# Altium schematic sheet POWER+HALL.SchDoc (part 2 of 3)
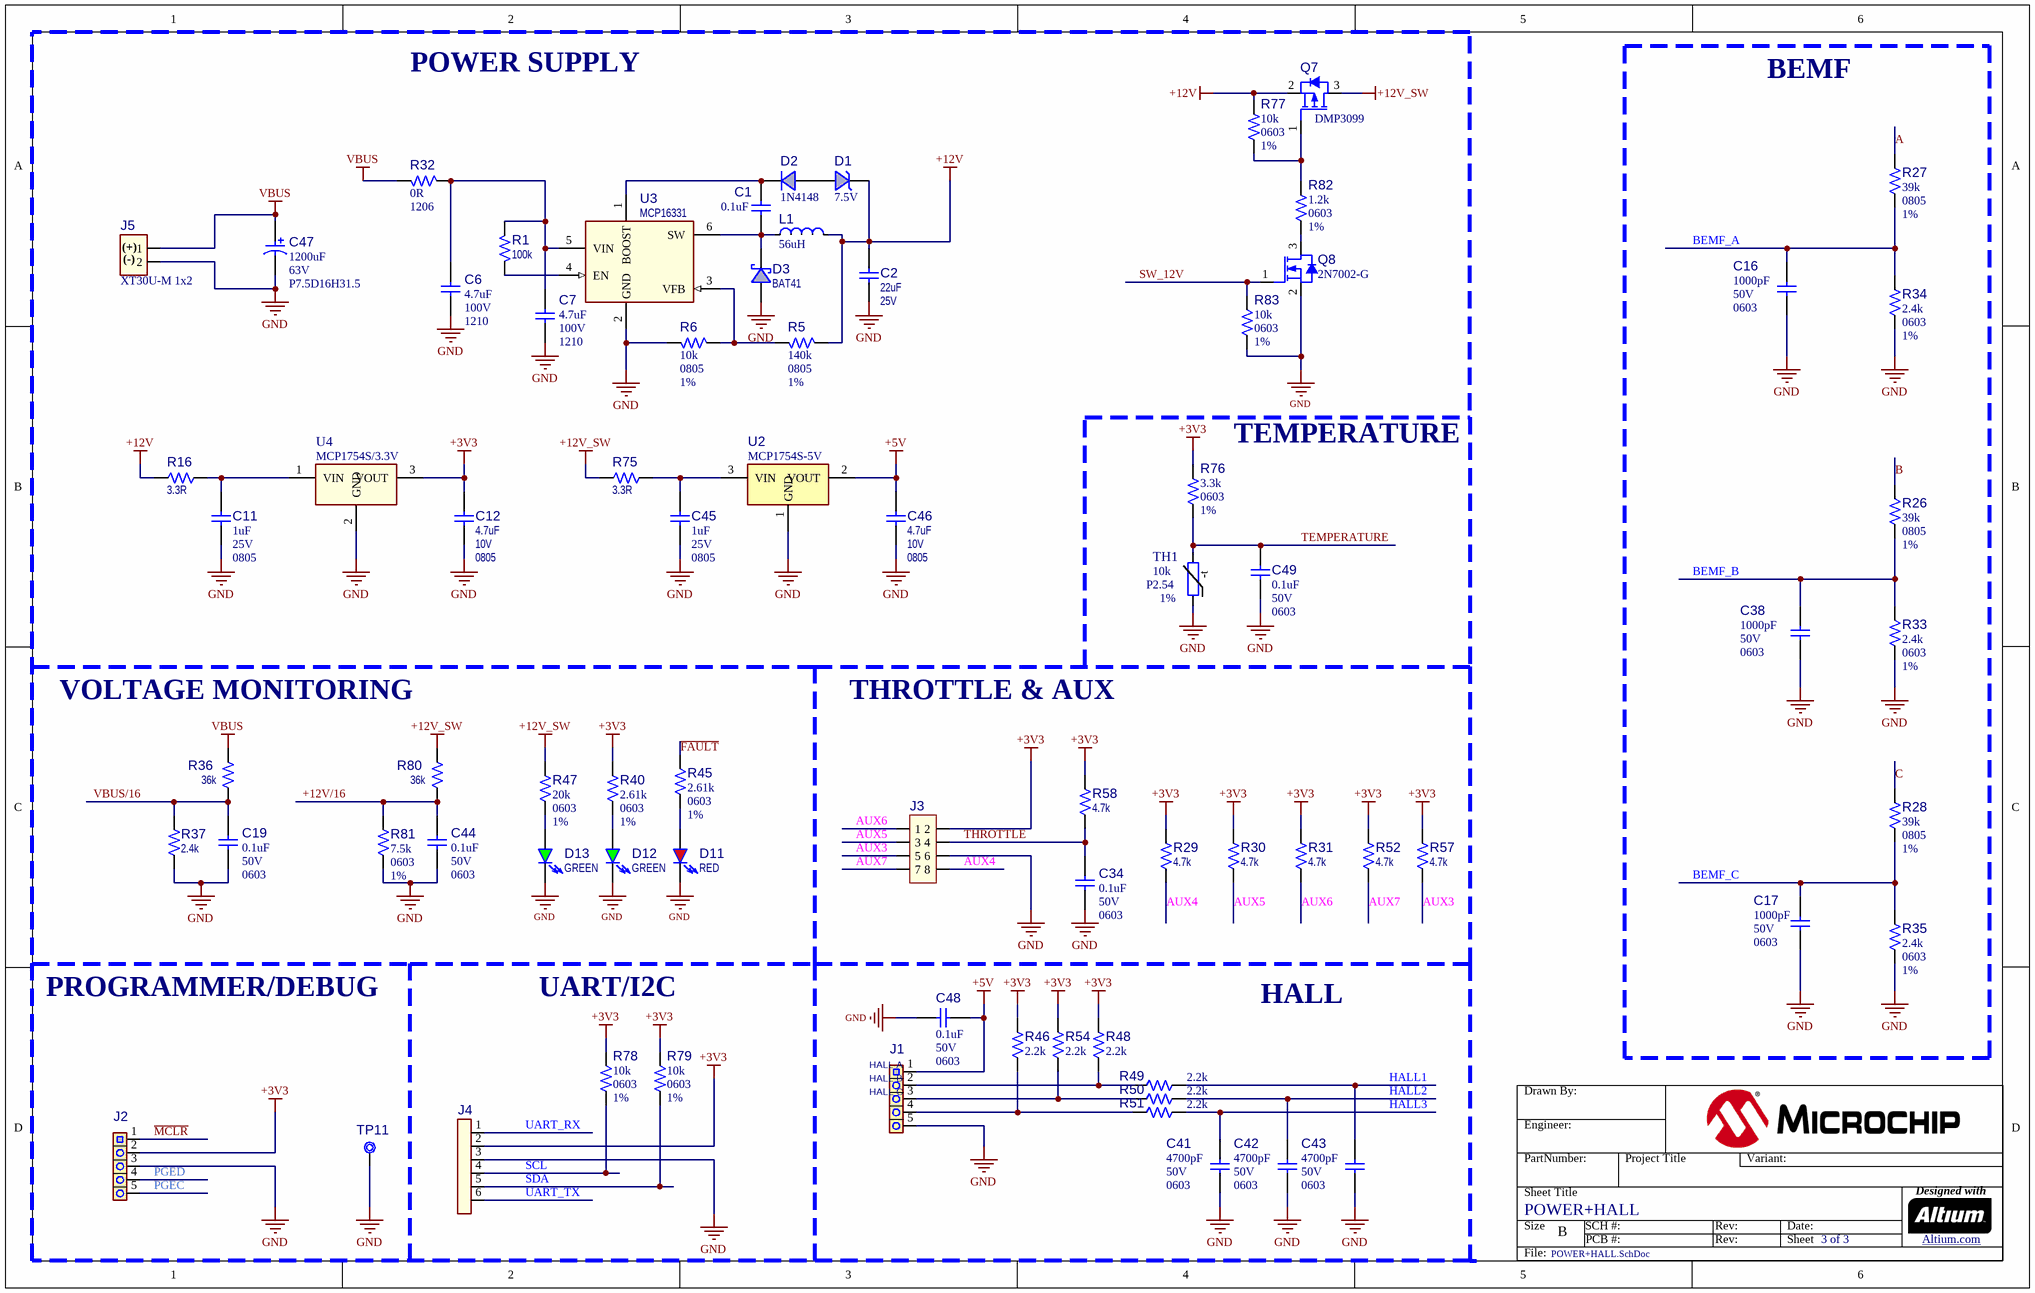
[diagram p1: POWER+HALL.SchDoc]
## Library data of the parts
? = Title Block B
C1 = CAP2016: Capacitor; Manufacturer 1: AVX Corporation; Manufacturer Part Number 1: 06035C104K4Z4A; Voltage: 50V; Description_: CAP CER 0.1uF 50V 10% X7R AEC-Q200 SMD 0603; Dev Tools Status: Design; Tolerance: 10%; Temperature Coeffcient: X7R; Type: Ceramic; Owner: Sam Charles; Populated: YES; MCHP-ID: CAP2016; Package: 0603; Revision: A; Symbol: Capacitor NP; Status: MCL Design; ComponentLink1URL: https://chn-vm-apps.microchip.com/mchprepo/parts/Datasheets/FlexitermMLCC.pdf; ComponentLink1Description: SVN Datasheet; ComponentLink2URL: C:\ALTIUM_WORK\00001_MCHP-CDB\Datasheets\FlexitermMLCC.pdf; ComponentLink2Description: Local Datasheet; ComponentLink3URL: C:\ALTIUM_WORK\00001_MCHP-CDB\Library\LibraryRefs\Capacitor NP.SchLib; ComponentLink3Description: Open Symbol; ComponentLink4URL: C:\ALTIUM_WORK\00001_MCHP-CDB\Library\Footprints\CAP_C_0603.PcbLib; ComponentLink4Description: Open Footprint; ComponentLink5Description: Open Footprint 2; ComponentLink6Description: Open Footprint 3; ComponentLink7Description: Open Footprint 4; Operating Temperature: -55°C ~ 125°C; Category: Capacitor; Supplier 1: Digi-Key; Supplier Part Number 1: 478-10679-1-ND; Quantity Override: 1
C2 = CAP1579: Capacitor; Manufacturer 1: Murata Electronics North America                                                                               Murata Electronics North America; Manufacturer Part Number 1: GRM31CR61E226KE15L; Description_: CAP CER 22uF 25V 10% X5R SMD 1206; Dev Tools Status: Production; Tolerance: 10%; Type: Ceramic; Owner: Jose Garcia; Populated: YES; MCHP-ID: CAP1579; Package: 1206; Revision: 2; Symbol: Capacitor NP; Status: MCL Design; ComponentLink1URL: https://chn-vm-apps.microchip.com/mchprepo/parts/Datasheets/c02e.pdf; ComponentLink1Description: SVN Datasheet; ComponentLink2URL: C:\ALTIUM_WORK\00001_MCHP-CDB\Datasheets\c02e.pdf; ComponentLink2Description: Local Datasheet; ComponentLink3URL: C:\ALTIUM_WORK\00001_MCHP-CDB\Library\LibraryRefs\Capacitor NP.SchLib; ComponentLink3Description: Open Symbol; ComponentLink4URL: C:\ALTIUM_WORK\00001_MCHP-CDB\Library\Footprints\CAP_C_1206.PcbLib; ComponentLink4Description: Open Footprint; ComponentLink5Description: Open Footprint 2; ComponentLink6Description: Open Footprint 3; ComponentLink7Description: Open Footprint 4; Operating Temperature: -55°C to +85°C; Category: Capacitor; Supplier 1: Digi-Key; Supplier Part Number 1: 490-5527-1-ND; Quantity Override: 1
C6 C7 = CAP1988: Capacitor; Manufacturer 1: Taiyo Yuden; Manufacturer Part Number 1: HMK325C7475KMHPE; Description_: CAP CER 4.7uF 100V 10% X7S SMD 1210 AEC-Q200; Dev Tools Status: Production; Tolerance: 10%; Temperature Coeffcient: X7S; Type: Ceramic; Owner: Cristian Papuc; Populated: YES; MCHP-ID: CAP1988; Revision: 1; Symbol: Capacitor NP; Status: MCL Design; ComponentLink1URL: https://chn-vm-apps.microchip.com/mchprepo/parts/Datasheets/HMK325C7475KMHPE_SS.pdf; ComponentLink1Description: SVN Datasheet; ComponentLink2URL: C:\ALTIUM_WORK\00001_MCHP-CDB\Datasheets\HMK325C7475KMHPE_SS.pdf; ComponentLink2Description: Local Datasheet; ComponentLink3URL: C:\ALTIUM_WORK\00001_MCHP-CDB\Library\LibraryRefs\Capacitor NP.SchLib; ComponentLink3Description: Open Symbol; ComponentLink4URL: C:\ALTIUM_WORK\00001_MCHP-CDB\Library\Footprints\CAP_C_1210.PcbLib; ComponentLink4Description: Open Footprint; ComponentLink5Description: Open Footprint 2; ComponentLink6Description: Open Footprint 3; ComponentLink7Description: Open Footprint 4; Operating Temperature: -55C to +125C; Category: Capacitor; Supplier 1: Digi-Key; Supplier Part Number 1: 587-5037-1-ND; Quantity Override: 1
C11 C45 = CAP1211: Capacitor; Manufacturer 1: AVX; Manufacturer Part Number 1: 08053C105K4Z2A; Description_: CAP CER 1uF 25V 10% X7R SMD 0805; Dev Tools Status: Production; Tolerance: 10%; Temperature Coeffcient: X7R; Type: Ceramic; Owner: Tad Ahlvers; Populated: YES; MCHP-ID: CAP1211; Revision: 1; Symbol: Capacitor NP; Status: MCL Design; ComponentLink1URL: https://chn-vm-apps.microchip.com/mchprepo/parts/Datasheets/flexiterm.pdf; ComponentLink1Description: SVN Datasheet; ComponentLink2URL: C:\ALTIUM_WORK\00001_MCHP-CDB\Datasheets\flexiterm.pdf; ComponentLink2Description: Local Datasheet; ComponentLink3URL: C:\ALTIUM_WORK\00001_MCHP-CDB\Library\LibraryRefs\Capacitor NP.SchLib; ComponentLink3Description: Open Symbol; ComponentLink4URL: C:\ALTIUM_WORK\00001_MCHP-CDB\Library\Footprints\CAP_C_0805.PcbLib; ComponentLink4Description: Open Footprint; ComponentLink5Description: Open Footprint 2; ComponentLink6Description: Open Footprint 3; ComponentLink7Description: Open Footprint 4; Operating Temperature: -55C to +125C; Category: Capacitor; Manufacturer 2: KEMET; Manufacturer Part Number 2: C0805C105K3RACTU; Manufacturer 3: TDK Corporation; Manufacturer Part Number 3: C2012X7R1E105K125AB; Supplier 1: Digi-Key; Supplier Part Number 1: 478-6357-2-ND; Supplier 2: Digi-Key; Supplier Part Number 2: C0805C105K3RACTU-ND; Supplier 3: Digi-Key; Supplier Part Number 3: 445-1354-1-ND; Quantity Override: 1
C12 C46 = CAP1268: Capacitor; Manufacturer 1: TDK Corporation; Manufacturer Part Number 1: C2012X7R1A475M125AC; Description_: CAP CER 4.7uF 10V 20% X7R SMD 0805; Dev Tools Status: Production; Tolerance: 20%; Temperature Coeffcient: X7R; Type: Ceramic; Owner: Mark Loper; Populated: YES; MCHP-ID: CAP1268; Revision: 1; Symbol: Capacitor NP; Status: MCL Design; ComponentLink1URL: https://chn-vm-apps.microchip.com/mchprepo/parts/Datasheets/mlcc_commercial_general_en.pdf; ComponentLink1Description: SVN Datasheet; ComponentLink2URL: C:\ALTIUM_WORK\00001_MCHP-CDB\Datasheets\mlcc_commercial_general_en.pdf; ComponentLink2Description: Local Datasheet; ComponentLink3URL: C:\ALTIUM_WORK\00001_MCHP-CDB\Library\LibraryRefs\Capacitor NP.SchLib; ComponentLink3Description: Open Symbol; ComponentLink4URL: C:\ALTIUM_WORK\00001_MCHP-CDB\Library\Footprints\CAP_C_0805.PcbLib; ComponentLink4Description: Open Footprint; ComponentLink5Description: Open Footprint 2; ComponentLink6Description: Open Footprint 3; ComponentLink7Description: Open Footprint 4; Operating Temperature: -55C to +125C; Category: Capacitor; Supplier 1: Digi-Key; Supplier Part Number 1: 445-1605-1-ND; Quantity Override: 1
C16 C17 C38 = CAP0031: Capacitor; Manufacturer 1: Wurth Electronics Inc; Manufacturer Part Number 1: 885012206083; Description_: CAP CER 1000pF 50V 10% X7R SMD 0603; Dev Tools Status: Production; Tolerance: 10%; Temperature Coeffcient: X7R; Type: Ceramic; Populated: Yes; MCHP-ID: CAP0031; Revision: 2; Symbol: Capacitor NP; Status: MCL Design; ComponentLink1URL: https://chn-vm-apps.microchip.com/mchprepo/parts/Datasheets/KEM_C1002_X7R_SMD.pdf; ComponentLink1Description: SVN Datasheet; ComponentLink2URL: C:\ALTIUM_WORK\00001_MCHP-CDB\Datasheets\KEM_C1002_X7R_SMD.pdf; ComponentLink2Description: Local Datasheet; ComponentLink3URL: C:\ALTIUM_WORK\00001_MCHP-CDB\Library\LibraryRefs\Capacitor NP.SchLib; ComponentLink3Description: Open Symbol; ComponentLink4URL: C:\ALTIUM_WORK\00001_MCHP-CDB\Library\Footprints\CAP_C_0603.PcbLib; ComponentLink4Description: Open Footprint; ComponentLink5Description: Open Footprint 2; ComponentLink6Description: Open Footprint 3; ComponentLink7Description: Open Footprint 4; Operating Temperature: -55C to +125C; Category: Capacitor; Manufacturer 2: Cal-Chip; Manufacturer Part Number 2: GMC10X7R102K50NTL_F; Manufacturer 3: AVX; Manufacturer Part Number 3: 06035C102KAT2A; Manufacturer 4: KEMET; Manufacturer Part Number 4: C0603C102K5RACTU; Manufacturer 5: Murata Electronics North America; Manufacturer Part Number 5: GCM188R71H102KA37J; Manufacturer 6: Panasonic; Manufacturer Part Number 6: ECU-V1H102KBV; Manufacturer 7: Panasonic; Manufacturer Part Number 7: ECJ-1VB1H102K; Manufacturer 8: NIC Components; Manufacturer Part Number 8: NMC0603X7R102K50TRPF; Supplier 1: Digi-Key; Supplier Part Number 1: 732-8001-1-ND; Supplier 2: Cal-Chip; Supplier Part Number 2: GMC10X7R102K50NTL_F; Supplier 3: Digi-Key; Supplier Part Number 3: 478-1215-1-ND; Supplier 4: Digi-Key; Supplier Part Number 4: 399-1082-1-ND; Supplier 5: Digi-Key; Supplier Part Number 5: 490-8019-1-ND; Supplier 6: Digi-Key; Supplier Part Number 6: PCC102BVTR-ND; Supplier 7: Digi-Key; Supplier Part Number 7: PCC1772TR-ND; Supplier 8: NIC Components; Supplier Part Number 8: NMC0603X7R102K50TRPF; Quantity Override: 1
C19 C34 C44 C48 C49 = CAP2016: Capacitor; Manufacturer 1: AVX Corporation; Manufacturer Part Number 1: 06035C104K4Z4A; Description_: CAP CER 0.1uF 50V 10% X7R AEC-Q200 SMD 0603; Dev Tools Status: Design; Tolerance: 10%; Temperature Coeffcient: X7R; Type: Ceramic; Owner: Sam Charles; Populated: YES; MCHP-ID: CAP2016; Revision: A; Symbol: Capacitor NP; Status: MCL Design; ComponentLink1URL: https://chn-vm-apps.microchip.com/mchprepo/parts/Datasheets/FlexitermMLCC.pdf; ComponentLink1Description: SVN Datasheet; ComponentLink2URL: C:\ALTIUM_WORK\00001_MCHP-CDB\Datasheets\FlexitermMLCC.pdf; ComponentLink2Description: Local Datasheet; ComponentLink3URL: C:\ALTIUM_WORK\00001_MCHP-CDB\Library\LibraryRefs\Capacitor NP.SchLib; ComponentLink3Description: Open Symbol; ComponentLink4URL: C:\ALTIUM_WORK\00001_MCHP-CDB\Library\Footprints\CAP_C_0603.PcbLib; ComponentLink4Description: Open Footprint; ComponentLink5Description: Open Footprint 2; ComponentLink6Description: Open Footprint 3; ComponentLink7Description: Open Footprint 4; Operating Temperature: -55°C ~ 125°C; Category: Capacitor; Supplier 1: Digi-Key; Supplier Part Number 1: 478-10679-1-ND; Quantity Override: 1
C41-C43 = CAP1116: Manufacturer 1: KEMET; Manufacturer Part Number 1: C0603C472K5RACTU; Description_: CAP CER 4700pF 50V 10% X7R SMD 0603; Dev Tools Status: Production; Tolerance: 10%; Temperature Coeffcient: X7R; Type: Ceramic; Populated: YES; Owner: Miahi T(M91442); MCHP-ID: CAP1116; Revision: 0; Symbol: Capacitor NP; Status: MCL Design; ComponentLink1URL: https://chn-vm-apps.microchip.com/mchprepo/parts/Datasheets/KEM_C1002_X7R_SMD.pdf; ComponentLink1Description: SVN Datasheet; ComponentLink2URL: C:\ALTIUM_WORK\00001_MCHP-CDB\Datasheets\KEM_C1002_X7R_SMD.pdf; ComponentLink2Description: Local Datasheet; ComponentLink3URL: C:\ALTIUM_WORK\00001_MCHP-CDB\Library\LibraryRefs\Capacitor NP.SchLib; ComponentLink3Description: Open Symbol; ComponentLink4URL: C:\ALTIUM_WORK\00001_MCHP-CDB\Library\Footprints\CAP_C_0603.PcbLib; ComponentLink4Description: Open Footprint; ComponentLink5Description: Open Footprint 2; ComponentLink6Description: Open Footprint 3; ComponentLink7Description: Open Footprint 4; Operating Temperature: -55C to +125C; Category: Capacitor; Supplier 1: Digi-Key; Supplier Part Number 1: 399-1087-1-ND; Supplier 2: Farnell; Supplier Part Number 2: 1414642; Quantity Override: 1
C47 = CAP2449: Capacitor; Manufacturer 1: Wurth Electronics; Manufacturer Part Number 1: 860040780019; Description_: CAP ALU 1200uF 63V 20% RAD P7.5D16H31.5; Dev Tools Status: Design; Tolerance: 20%; Type: Aluminum; Owner: Cristina Salanti; Populated: YES; MCHP-ID: CAP2449; Revision: 1; Symbol: Capacitor POL; Status: MCL Design; ComponentLink1URL: https://chn-vm-apps.microchip.com/mchprepo/parts/Datasheets/860040780019.pdf; ComponentLink1Description: SVN Datasheet; ComponentLink2URL: C:\ALTIUM_WORK\00001_MCHP-CDB\Datasheets\860040780019.pdf; ComponentLink2Description: Local Datasheet; ComponentLink3URL: C:\ALTIUM_WORK\00001_MCHP-CDB\Library\LibraryRefs\Capacitor POL.SchLib; ComponentLink3Description: Open Symbol; ComponentLink4URL: C:\ALTIUM_WORK\00001_MCHP-CDB\Library\Footprints\CAP_RAD_P7.5D16H31.5.PcbLib; ComponentLink4Description: Open Footprint; ComponentLink5Description: Open Footprint 2; ComponentLink6Description: Open Footprint 3; ComponentLink7Description: Open Footprint 4; Operating Temperature: -40C to +105C; Category: Capacitor; Supplier 1: Digikey; Supplier Part Number 1: 732-9250-ND; Quantity Override: 1
D1 = DIODE1401: Manufacturer 1: ON Semiconductor; Manufacturer Part Number 1: MMSZ7V5T1G; Description_: DIO ZNR MMSZ7V5T1G 7.5V 500mW SMD SOD-123; Dev Tools Status: Production; Type: Zener Single; Power: 500mW; Reverse Current: 1µA@5V; Owner: Cristian Papuc; Populated: YES; MCHP-ID: DIODE1401; Revision: 1; Symbol: Diode Zener; Status: MCL Design; Package: SOD-123; ComponentLink1URL: https://chn-vm-apps.microchip.com/mchprepo/parts/Datasheets/MMSZ2V4T1-D.PDF; ComponentLink1Description: SVN Datasheet; ComponentLink2URL: C:\ALTIUM_WORK\00001_MCHP-CDB\Datasheets\MMSZ2V4T1-D.PDF; ComponentLink2Description: Local Datasheet; ComponentLink3URL: C:\ALTIUM_WORK\00001_MCHP-CDB\Library\LibraryRefs\Diode Zener.SchLib; ComponentLink3Description: Open Symbol; ComponentLink4URL: C:\ALTIUM_WORK\00001_MCHP-CDB\Library\Footprints\SOD-123.PcbLib; ComponentLink4Description: Open Footprint; ComponentLink5Description: Open Footprint 2; ComponentLink6Description: Open Footprint 3; ComponentLink7Description: Open Footprint 4; Operating Temperature: -55°C ~ 150°C; Category: Diode; Supplier 1: Digi-Key; Supplier Part Number 1: MMSZ7V5T1GOSCT-ND; Quantity Override: 1
D2 = DIODE0165: Manufacturer 1: Fairchild; Manufacturer Part Number 1: 1N4148WS; Description_: DIO RECT 1N4148 1V 150mA 100V SOD-323; Dev Tools Status: Production; Type: Rectifier Single; Forward Current: 150mA; Power: 200mW; Reverse Current: 5uA; Reverse Voltage: 100V; Populated: Yes; MCHP-ID: DIODE0165; Revision: 1; Symbol: Diode Single; Status: MCL Design; Package: SOD-323; ComponentLink1URL: https://chn-vm-apps.microchip.com/mchprepo/parts/Datasheets/1N4148WS.pdf; ComponentLink1Description: SVN Datasheet; ComponentLink2URL: C:\ALTIUM_WORK\00001_MCHP-CDB\Datasheets\1N4148WS.pdf; ComponentLink2Description: Local Datasheet; ComponentLink3URL: C:\ALTIUM_WORK\00001_MCHP-CDB\Library\LibraryRefs\Diode Single.SchLib; ComponentLink3Description: Open Symbol; ComponentLink4URL: C:\ALTIUM_WORK\00001_MCHP-CDB\Library\Footprints\SOD-323.PcbLib; ComponentLink4Description: Open Footprint; ComponentLink5Description: Open Footprint 2; ComponentLink6Description: Open Footprint 3; ComponentLink7Description: Open Footprint 4; Operating Temperature: -55C to +150C; Category: Diode; Supplier 1: Digi-Key; Supplier Part Number 1: 1N4148WSFSCT-ND; Quantity Override: 1
D3 = DIODE0160: Manufacturer 1: STMicroelectronics; Manufacturer Part Number 1: BAT41ZFILM; Description_: DIO SCTKY BAT41 1V 200mA 100V SOD-123; Dev Tools Status: Production; Type: Schottky Single; Forward Current: 200mA; Reverse Current: 100nA; Reverse Voltage: 100V; Populated: Yes; MCHP-ID: DIODE0160; Revision: 1; Symbol: Diode Schottky; Status: MCL Design; Package: SOD-123; ComponentLink1URL: https://chn-vm-apps.microchip.com/mchprepo/parts/Datasheets/CD00130227.pdf; ComponentLink1Description: SVN Datasheet; Operating Temperature: -65C to +150C; Category: Diode; Supplier 1: Digi-Key; Supplier Part Number 1: 497-5558-1-ND; Quantity Override: 1; ComponentLink2Description: Local Datasheet; ComponentLink2URL: C:\ALTIUM_WORK\00001_MCHP-CDB\Datasheets\CD00130227.pdf; ComponentLink3Description: Open Symbol; ComponentLink3URL: C:\ALTIUM_WORK\00001_MCHP-CDB\Library\LibraryRefs\Diode Schottky.SchLib; ComponentLink4Description: Open Footprint; ComponentLink4URL: C:\ALTIUM_WORK\00001_MCHP-CDB\Library\Footprints\SOD-123.PcbLib; ComponentLink5Description: Open Footprint 2; ComponentLink6Description: Open Footprint 3; ComponentLink7Description: Open Footprint 4
D11 = DIODE1058: LED; Manufacturer 1: Lite-On; Manufacturer Part Number 1: LTST-C190EKT; Description_: DIO LED RED 2V 30mA 2mcd Clear SMD 0603; Dev Tools Status: Production; Type: LED Single; Forward Current: 30mA; Power: 100mW; Reverse Current: 100uA; Reverse Voltage: 5V; Owner: Tad Ahlvers; Populated: YES; MCHP-ID: DIODE1058; Revision: 2; Symbol: LED_red; Status: MCL Design; Package: 0603; ComponentLink1URL: https://chn-vm-apps.microchip.com/mchprepo/parts/Datasheets/LTST-C190EKT.pdf; ComponentLink1Description: SVN Datasheet; ComponentLink2URL: C:\ALTIUM_WORK\00001_MCHP-CDB\Datasheets\LTST-C190EKT.pdf; ComponentLink2Description: Local Datasheet; ComponentLink3URL: C:\ALTIUM_WORK\00001_MCHP-CDB\Library\LibraryRefs\LED_red.SchLib; ComponentLink3Description: Open Symbol; ComponentLink4URL: C:\ALTIUM_WORK\00001_MCHP-CDB\Library\Footprints\LED_0603_RED.PcbLib; ComponentLink4Description: Open Footprint; ComponentLink5Description: Open Footprint 2; ComponentLink6Description: Open Footprint 3; ComponentLink7Description: Open Footprint 4; Operating Temperature: -55C to +85C; Category: Diode; Manufacturer 2: ZhiDing; Manufacturer Part Number 2: AL-S0603SRC-50-08-2; Supplier 1: Digi-Key; Supplier Part Number 1: 160-1182-1-ND; Supplier 2: Raynen; Supplier Part Number 2: AL-S0603SRC-50-08-2; Quantity Override: 1
D12 D13 = DIODE1155: LED; Manufacturer 1: Lite-On Inc; Manufacturer Part Number 1: LTST-C191KGKT; Description_: DIO LED GREEN 2V 30mA 35mcd Clear SMD 0603; Dev Tools Status: Production; Type: LED Single; Forward Current: 30mA; Power: 75mW; Reverse Voltage: 5V; Owner: Tad Ahlvers; Populated: YES; MCHP-ID: DIODE1155; Revision: 1; Symbol: LED_green; Status: MCL Design; ComponentLink1URL: https://chn-vm-apps.microchip.com/mchprepo/parts/Datasheets/S_110_LTST-C191KGKT.pdf; ComponentLink1Description: SVN Datasheet; ComponentLink2URL: C:\ALTIUM_WORK\00001_MCHP-CDB\Datasheets\S_110_LTST-C191KGKT.pdf; ComponentLink2Description: Local Datasheet; ComponentLink3URL: C:\ALTIUM_WORK\00001_MCHP-CDB\Library\LibraryRefs\LED_green.SchLib; ComponentLink3Description: Open Symbol; ComponentLink4URL: C:\ALTIUM_WORK\00001_MCHP-CDB\Library\Footprints\LED_0603_GREEN.PcbLib; ComponentLink4Description: Open Footprint; ComponentLink5Description: Open Footprint 2; ComponentLink6Description: Open Footprint 3; ComponentLink7Description: Open Footprint 4; Operating Temperature: -55C to +85C; Category: Diode; Manufacturer 2: Ledtech; Manufacturer Part Number 2: LT8A23-54-SB96-T5; Supplier 1: Digi-Key; Supplier Part Number 1: 160-1446-1-ND; Supplier 2: Raynen; Supplier Part Number 2: LEDD00036B01; Quantity Override: 1
J1 J2 = CON0416: Manufacturer 1: FCI; Manufacturer Part Number 1: 68000-105HLF; Value: HDR-2.54 Male 1x5; Description_: CON HDR-2.54 Male 1x5 Gold 5.84MH TH VERT; Dev Tools Status: Production; Populated: Yes; MCHP-ID: CON0416; Revision: 1; Symbol: Header 1x5; Status: MCL Design; ComponentLink1URL: https://chn-vm-apps.microchip.com/mchprepo/parts/Datasheets/TSW-XXX-XX-XXX-X-XX-XXX-MKT.pdf; ComponentLink1Description: SVN Datasheet; ComponentLink2URL: C:\ALTIUM_WORK\00001_MCHP-CDB\Datasheets\TSW-XXX-XX-XXX-X-XX-XXX-MKT.pdf; ComponentLink2Description: Local Datasheet; ComponentLink3URL: C:\ALTIUM_WORK\00001_MCHP-CDB\Library\LibraryRefs\Header 1x5.SchLib; ComponentLink3Description: Open Symbol; ComponentLink4URL: C:\ALTIUM_WORK\00001_MCHP-CDB\Library\Footprints\HDR_M_2.54_1x5.PcbLib; ComponentLink4Description: Open Footprint; ComponentLink5Description: Open Footprint 2; ComponentLink6Description: Open Footprint 3; ComponentLink7Description: Open Footprint 4; Type: Header 2.54mm; Category: Connector; Manufacturer 2: Samtec; Manufacturer Part Number 2: TSW-105-07-S-S; Manufacturer 3: Nextron; Manufacturer Part Number 3: 211-051A7-0021-400; Supplier 1: Digi-Key; Supplier Part Number 1: 609-3462-ND; Supplier 2: Digi-Key; Supplier Part Number 2: SAM1033-05-ND; Supplier 3: Raynen; Supplier Part Number 3: CONN00303A01M; Quantity Override: 1
J3 = CON0118: Manufacturer 1: Wurth Electronics Inc; Manufacturer Part Number 1: 61300821121; Value: HDR-2.54 Male 2x4; Description_: CON HDR-2.54 Male 2x4 Gold 5.84MH  TH VERT; Dev Tools Status: Production; Owner: Randolph Sobrepena; Populated: Yes; MCHP-ID: CON0118; Revision: 2; Symbol: Header 2x4; Status: MCL Design; ComponentLink1URL: https://chn-vm-apps.microchip.com/mchprepo/parts/Datasheets/TSW-XXX-XX-XXX-X-XX-XXX-MKT.pdf; ComponentLink1Description: SVN Datasheet; ComponentLink2URL: C:\ALTIUM_WORK\00001_MCHP-CDB\Datasheets\TSW-XXX-XX-XXX-X-XX-XXX-MKT.pdf; ComponentLink2Description: Local Datasheet; ComponentLink3URL: C:\ALTIUM_WORK\00001_MCHP-CDB\Library\LibraryRefs\Header 2x4.SchLib; ComponentLink3Description: Open Symbol; ComponentLink4URL: C:\ALTIUM_WORK\00001_MCHP-CDB\Library\Footprints\HDR_M_2.54_2x4.PcbLib; ComponentLink4Description: Open Footprint; ComponentLink5Description: Open Footprint 2; ComponentLink6Description: Open Footprint 3; ComponentLink7Description: Open Footprint 4; Type: Header 2.54mm; Category: Connector; Manufacturer 2: Sullins; Manufacturer Part Number 2: PBC04DAAN; Supplier 1: Digi-Key; Supplier Part Number 1: 732-5296-ND; Supplier 2: Digi-Key; Supplier Part Number 2: S2011E-04-ND; Quantity Override: 1; Manufacturer 3: Samtec; Manufacturer Part Number 3: TSW-104-07-G-D; Manufacturer 4: Samtec; Manufacturer Part Number 4: TSW-104-07-S-D; Manufacturer 5: SHENZHEN JUNHAO ENGINEERING; Manufacturer Part Number 5: R-213-0811-0021-400; Supplier 3: Samtec; Supplier Part Number 3: TSW-104-07-G-D; Supplier 4: Samtec; Supplier Part Number 4: TSW-104-07-S-D; Supplier 5: Raynen; Supplier Part Number 5: CONN00267B01
J4 = CON2100: Manufacturer 1: WURTH ELEKTRONIK; Manufacturer Part Number 1: 61300611121; Value: HDR-2.54 Male 1x6; Description_: CON HDR-2.54 Male 1x6 Tin 5.84MH TH VERT; Dev Tools Status: Production; Owner: Octavian Stroe; Populated: YES; Current: 3A; MCHP-ID: CON2100; Revision: 1; Symbol: Header 1x6; Status: MCL Design; ComponentLink1URL: https://chn-vm-apps.microchip.com/mchprepo/parts/Datasheets/6130xx11121.pdf; ComponentLink1Description: SVN Datasheet; ComponentLink2URL: C:\ALTIUM_WORK\00001_MCHP-CDB\Datasheets\6130xx11121.pdf; ComponentLink2Description: Local Datasheet; ComponentLink3URL: C:\ALTIUM_WORK\00001_MCHP-CDB\Library\LibraryRefs\Header 1x6.SchLib; ComponentLink3Description: Open Symbol; ComponentLink4URL: C:\ALTIUM_WORK\00001_MCHP-CDB\Library\Footprints\HDR_M_2.54_1x6.PcbLib; ComponentLink4Description: Open Footprint; ComponentLink5Description: Open Footprint 2; ComponentLink6Description: Open Footprint 3; ComponentLink7Description: Open Footprint 4; Type: Header 2.54mm; Category: Connector; Supplier 1: Digi-Key; Supplier Part Number 1: 732-5319-ND; Quantity Override: 1
J5 = CON2207: Manufacturer 1: AMASS; Manufacturer Part Number 1: XT30U-M; Description_: CON POWER XT30U-M 5mm 1x2 Male 15A TH V; Dev Tools Status: Design; Owner: Octavian Stroe; Voltage: 500V; Current: 15A; Populated: YES; MCHP-ID: CON2207; Revision: 1; Symbol: CON 1x2 POLARIZED; Status: MCL Design; ComponentLink1URL: https://chn-vm-apps.microchip.com/mchprepo/parts/Datasheets/XT30U SPEC.pdf; ComponentLink1Description: SVN Datasheet; ComponentLink2URL: C:\ALTIUM_WORK\00001_MCHP-CDB\Datasheets\XT30U SPEC.pdf; ComponentLink2Description: Local Datasheet; ComponentLink3URL: C:\ALTIUM_WORK\00001_MCHP-CDB\Library\LibraryRefs\CON 1x2 POLARIZED.SchLib; ComponentLink3Description: Open Symbol; ComponentLink4URL: C:\ALTIUM_WORK\00001_MCHP-CDB\Library\Footprints\CON TERMINAL XT30U-M 5mm 1x2 Male 30A TH V.PcbLib; ComponentLink4Description: Open Footprint; ComponentLink5Description: Open Footprint 2; ComponentLink6Description: Open Footprint 3; ComponentLink7Description: Open Footprint 4; Type: Power; Category: Connector; Supplier 1: TME; Supplier Part Number 1: XT30U-M; Quantity Override: 1
L1 = IND1145: Manufacturer 1: WURTH ELEKTRONIK; Manufacturer Part Number 1: 7447779156; Description_: INDUCTOR 56uH 0.93A 20% SMD L7.3W7.3H4.5; Dev Tools Status: Design; Owner: Bogdan P (M91398); DCR: 0.35R; Saturation Current: 1.05A; RMS Current: 0.93A; Test Frequency: 1kHz; Populated: YES; MCHP-ID: IND1145; Revision: A; Symbol: Inductor; Status: MCL Design; ComponentLink1URL: https://chn-vm-apps.microchip.com/mchprepo/parts/Datasheets/7447779156.pdf; ComponentLink1Description: SVN Datasheet; ComponentLink2URL: C:\ALTIUM_WORK\00001_MCHP-CDB\Datasheets\7447779156.pdf; ComponentLink2Description: Local Datasheet; ComponentLink3URL: C:\ALTIUM_WORK\00001_MCHP-CDB\Library\LibraryRefs\Inductor.SchLib; ComponentLink3Description: Open Symbol; ComponentLink4URL: C:\ALTIUM_WORK\00001_MCHP-CDB\Library\Footprints\IND_WE_WE-PD_L7.3W7.3H4.5.PcbLib; ComponentLink4Description: Open Footprint; ComponentLink5Description: Open Footprint 2; ComponentLink6Description: Open Footprint 3; ComponentLink7Description: Open Footprint 4; Operating Temperature: -40°C to +125°C; Package: L7.3W7.3H4.5; Type: Inductor; Category: Inductor; Supplier 1: Farnell; Supplier Part Number 1: 2082711; Quantity Override: 1
Q7 = TRA1191: Transistor MOS; Manufacturer 1: Diodes Incorporated; Manufacturer Part Number 1: DMP3099L-7; Description_: TRANS FET P-CH DMP3099L-7 -30V -3.8A 1.08W SOT-23-3; Dev Tools Status: Production; Type: FET; Current: -3.8A; Drain to Source Voltage: -30V; Gate to Source Voltage: 20V; Power: 1.08W; Owner: Alexandru Chiser - M19201; Populated: YES; MCHP-ID: TRA1191; Revision: 1; Symbol: Transistor MOS-P GSD; Status: MCL Design; Package: SOT-23-3; ComponentLink1URL: https://chn-vm-apps.microchip.com/mchprepo/parts/Datasheets/DMP3099L.pdf; ComponentLink1Description: SVN Datasheet; ComponentLink2URL: C:\ALTIUM_WORK\00001_MCHP-CDB\Datasheets\DMP3099L.pdf; ComponentLink2Description: Local Datasheet; ComponentLink3URL: C:\ALTIUM_WORK\00001_MCHP-CDB\Library\LibraryRefs\Transistor MOS-P GSD.SchLib; ComponentLink3Description: Open Symbol; ComponentLink4URL: C:\ALTIUM_WORK\00001_MCHP-CDB\Library\Footprints\SOT-23-3.PcbLib; ComponentLink4Description: Open Footprint; ComponentLink5Description: Open Footprint 2; ComponentLink6Description: Open Footprint 3; ComponentLink7Description: Open Footprint 4; Operating Temperature: -55C to +150C; Category: Transistor; Supplier 1: Digi-Key; Supplier Part Number 1: DMP3099L-7DICT-ND; Quantity Override: 1
Q8 = MIC7247: Transistor MOS; Manufacturer 1: Microchip Technology; Description_: MCHP ANALOG MOSFET N-CH 2N7002-G 60V 115mA SOT-23-3; Type: MOSFET; Dev Tools Status: Production; Owner: Mark Loper; Populated: YES; MCHP-ID: MIC7247; Symbol: Transistor MOS-N GSD; Status: MCL Design; Revision: 1; Category: MCHP-Analog; ComponentLink1Description: SVN Datasheet; ComponentLink2URL: C:\ALTIUM_WORK\00001_MCHP-CDB\Datasheets\2N7002.pdf; ComponentLink2Description: Local Datasheet; ComponentLink3URL: C:\ALTIUM_WORK\00001_MCHP-CDB\Library\LibraryRefs\Transistor MOS-N GSD.SchLib; ComponentLink3Description: Open Symbol; ComponentLink4URL: C:\ALTIUM_WORK\00001_MCHP-CDB\Library\Footprints\SOT-23-3.PcbLib; ComponentLink4Description: Open Footprint; ComponentLink5Description: Open Footprint 2; ComponentLink6Description: Open Footprint 3; ComponentLink7Description: Open Footprint 4; Manufacturer Part Number 1: 2N7002-G; Supplier 1: Digi-Key; Supplier Part Number 1: 2N7002-GMCCT-ND; Quantity Override: 1
R1 = RES1066: Manufacturer 1: Vishay; Manufacturer Part Number 1: MCT06030C1003FP500; Tolerance: 1%; Description_: RES TF 100k 1% 1/8W SMD 0603; Dev Tools Status: Production; Voltage: 75V; Temperature Coeffcient: 50ppm/C; Power: 1/8W; Owner: Tad Ahlvers; Populated: Yes; MCHP-ID: RES1066; Package: 0603; Revision: 1; Symbol: Resistor; Status: MCL Design; ComponentLink1URL: https://chn-vm-apps.microchip.com/mchprepo/parts/Datasheets/mc_pro.pdf; ComponentLink1Description: SVN Datasheet; Operating Temperature: -55C to +155C; Category: Resistor; Type: RES SMD; Composition: TF; Supplier 1: Digi-Key; Supplier Part Number 1: MCT0603-100K-CFTR-ND; Quantity Override: 1; ComponentLink2Description: Local Datasheet; ComponentLink2URL: C:\ALTIUM_WORK\00001_MCHP-CDB\Datasheets\mc_pro.pdf; ComponentLink3Description: Open Symbol; ComponentLink3URL: C:\ALTIUM_WORK\00001_MCHP-CDB\Library\LibraryRefs\Resistor.SchLib; ComponentLink4Description: Open Footprint; ComponentLink4URL: C:\ALTIUM_WORK\00001_MCHP-CDB\Library\Footprints\RES_C_0603.PcbLib; ComponentLink5Description: Open Footprint 2; ComponentLink6Description: Open Footprint 3; ComponentLink7Description: Open Footprint 4
R5 = RSMT1109: Manufacturer 1: Vishay Dale; Manufacturer Part Number 1: CRCW0805140KFKEA; Description_: RES TKF 140k 1% 1/8W SMD 0805; Dev Tools Status: Design; Voltage: 150V; Temperature Coeffcient: 100ppm/C; Power: 1/8W; Owner: Bogdan Popescu; Populated: YES; MCHP-ID: RSMT1109; Revision: A; Symbol: Resistor; Status: MCL Design; ComponentLink1URL: https://chn-vm-apps.microchip.com/mchprepo/parts/Datasheets/dcrcwe3.pdf; ComponentLink1Description: SVN Datasheet; ComponentLink2URL: C:\ALTIUM_WORK\00001_MCHP-CDB\Datasheets\dcrcwe3.pdf; ComponentLink2Description: Local Datasheet; ComponentLink3URL: C:\ALTIUM_WORK\00001_MCHP-CDB\Library\LibraryRefs\Resistor.SchLib; ComponentLink3Description: Open Symbol; ComponentLink4URL: C:\ALTIUM_WORK\00001_MCHP-CDB\Library\Footprints\RES_C_0805.PcbLib; ComponentLink4Description: Open Footprint; ComponentLink5Description: Open Footprint 2; ComponentLink6Description: Open Footprint 3; ComponentLink7Description: Open Footprint 4; Operating Temperature: -55C to +155C; Category: Resistor; Type: RES SMD; Composition: TKF; Supplier 1: Digi-Key; Supplier Part Number 1: 541-140KCCT-ND; Quantity Override: 1
R6 = RSMT0156: Manufacturer 1: Panasonic; Manufacturer Part Number 1: ERJ-6ENF1002V; Description_: RES TKF 10k 1% 1/8W SMD 0805; Dev Tools Status: Production; Voltage: 150V; Temperature Coeffcient: 100ppm/C; Power: 1/8W; Populated: Yes; MCHP-ID: RSMT0156; Revision: 1; Symbol: Resistor; Status: MCL Design; ComponentLink1URL: https://chn-vm-apps.microchip.com/mchprepo/parts/Datasheets/AOA0000CE1.pdf; ComponentLink1Description: SVN Datasheet; ComponentLink2URL: C:\ALTIUM_WORK\00001_MCHP-CDB\Datasheets\AOA0000CE1.pdf; ComponentLink2Description: Local Datasheet; ComponentLink3URL: C:\ALTIUM_WORK\00001_MCHP-CDB\Library\LibraryRefs\Resistor.SchLib; ComponentLink3Description: Open Symbol; ComponentLink4URL: C:\ALTIUM_WORK\00001_MCHP-CDB\Library\Footprints\RES_C_0805.PcbLib; ComponentLink4Description: Open Footprint; ComponentLink5Description: Open Footprint 2; ComponentLink6Description: Open Footprint 3; ComponentLink7Description: Open Footprint 4; Operating Temperature: -55C to +155C; Category: Resistor; Type: RES SMD; Composition: TKF; Manufacturer 2: SPC Technology; Manufacturer Part Number 2: MC0805WAF1002T5E-TC; Manufacturer 3: Stackpole Electronics Inc; Manufacturer Part Number 3: RMCF 1/10-10K-1%; Manufacturer 4: Vishay Dale; Manufacturer Part Number 4: CRCW080510K0FKEA; Supplier 1: Digi-Key; Supplier Part Number 1: P10.0KCTR-ND; Supplier 2: Newark; Supplier Part Number 2: 58K4692; Supplier 3: Stackpole Electronics Inc; Supplier Part Number 3: RMCF 1/10-10K-1%; Supplier 4: Digi-Key; Supplier Part Number 4: 541-10.0KCTR-ND; Quantity Override: 1
R16 R75 = RES2216: Manufacturer 1: Stackpole Electronics Inc; Manufacturer Part Number 1: RMCF0805FT3R30; Tolerance: 1%; Description_: RES TKF 3.3R 1% 1/8W SMD 0805 AEC-Q200; Dev Tools Status: Design; Temperature Coeffcient: 200ppm/C; Power: 1/8W; Owner: Gabor Bihari; Populated: YES; MCHP-ID: RES2216; Package: 0805; Revision: A; Symbol: Resistor; Status: MCL Design; ComponentLink1URL: https://chn-vm-apps.microchip.com/mchprepo/parts/Datasheets/SEI-RMCF_RMCP.pdf; ComponentLink1Description: SVN Datasheet; ComponentLink2URL: C:\ALTIUM_WORK\00001_MCHP-CDB\Datasheets\SEI-RMCF_RMCP.pdf; ComponentLink2Description: Local Datasheet; ComponentLink3URL: C:\ALTIUM_WORK\00001_MCHP-CDB\Library\LibraryRefs\Resistor.SchLib; ComponentLink3Description: Open Symbol; ComponentLink4URL: C:\ALTIUM_WORK\00001_MCHP-CDB\Library\Footprints\RES_C_0805.PcbLib; ComponentLink4Description: Open Footprint; ComponentLink5Description: Open Footprint 2; ComponentLink6Description: Open Footprint 3; ComponentLink7Description: Open Footprint 4; Operating Temperature: -55°C - 155°C; Category: Resistor; Type: RES SMD; Composition: TKF; Supplier 1: Digi-Key; Supplier Part Number 1: RMCF0805FT3R30CT-ND; Quantity Override: 1
R26-R28 = RES2677: Manufacturer 1: Stackpole Electronics Inc; Manufacturer Part Number 1: RMCF0805FT39K0; Description_: RES TKF 39k 1% 1/8W SMD 0805; Dev Tools Status: Design; Voltage: 150V; Temperature Coeffcient: 100ppm/C; Power: 1/8W; Owner: Octavian Stroe; Populated: YES; MCHP-ID: RES2677; Revision: 1; Symbol: Resistor; Status: MCL Design; ComponentLink1URL: https://chn-vm-apps.microchip.com/mchprepo/parts/Datasheets/sei-rmcf_rmcp.pdf; ComponentLink1Description: SVN Datasheet; ComponentLink2URL: C:\ALTIUM_WORK\00001_MCHP-CDB\Datasheets\sei-rmcf_rmcp.pdf; ComponentLink2Description: Local Datasheet; ComponentLink3URL: C:\ALTIUM_WORK\00001_MCHP-CDB\Library\LibraryRefs\Resistor.SchLib; ComponentLink3Description: Open Symbol; ComponentLink4URL: C:\ALTIUM_WORK\00001_MCHP-CDB\Library\Footprints\RES_C_0805.PcbLib; ComponentLink4Description: Open Footprint; ComponentLink5Description: Open Footprint 2; ComponentLink6Description: Open Footprint 3; ComponentLink7Description: Open Footprint 4; Operating Temperature: -55C to +155C; Category: Resistor; Type: RES SMD; Composition: TKF; Supplier 1: Digi-Key; Supplier Part Number 1: RMCF0805FT39K0CT-ND; Quantity Override: 1
R29-R31 R52 R57 R58 = RSMT0713: Manufacturer 1: Digi-Key; Manufacturer Part Number 1: 311-4.70KHRTR-ND; Tolerance: 1%; Description_: RES TKF 4.7k 1% 1/10W SMD 0603; Dev Tools Status: Production; Voltage: 50V; Temperature Coeffcient: 100ppm/C; Current: 1A; Power: 1/10W; Populated: Yes; MCHP-ID: RSMT0713; Package: 0603; Revision: 2; Symbol: Resistor; Status: MCL Design; ComponentLink1URL: https://chn-vm-apps.microchip.com/mchprepo/parts/Datasheets/SEI-RMCF_RMCP.pdf; ComponentLink1Description: SVN Datasheet; ComponentLink2URL: C:\ALTIUM_WORK\00001_MCHP-CDB\Datasheets\SEI-RMCF_RMCP.pdf; ComponentLink2Description: Local Datasheet; ComponentLink3URL: C:\ALTIUM_WORK\00001_MCHP-CDB\Library\LibraryRefs\Resistor.SchLib; ComponentLink3Description: Open Symbol; ComponentLink4URL: C:\ALTIUM_WORK\00001_MCHP-CDB\Library\Footprints\RES_C_0603.PcbLib; ComponentLink4Description: Open Footprint; ComponentLink5Description: Open Footprint 2; ComponentLink6Description: Open Footprint 3; ComponentLink7Description: Open Footprint 4; Operating Temperature: -55C to +155C; Category: Resistor; Type: RES SMD; Composition: TKF; Manufacturer 2: ROHM; Manufacturer Part Number 2: MCR03EZPFX4701; Manufacturer 3: Stackpole Electronics Inc; Manufacturer Part Number 3: RMCF0603FT4K70; Supplier 1: Digi-Key; Supplier Part Number 1: 311-4.70KHRTR-ND; Supplier 2: Digi-Key; Supplier Part Number 2: RHM4.70KHCT-ND; Supplier 3: Digi-Key; Supplier Part Number 3: RMCF0603FT4K70CT-ND; Quantity Override: 1
R32 = RSMT0003: Manufacturer 1: Yageo; Manufacturer Part Number 1: RC1206JR-070RL; Description_: RES TKF 0R SMD 1206; Dev Tools Status: Production; Current: 2A; Populated: Yes; MCHP-ID: RSMT0003; Revision: 1; Symbol: Resistor; Status: MCL Design; ComponentLink1URL: https://chn-vm-apps.microchip.com/mchprepo/parts/Datasheets/AOA0000CE1.pdf; ComponentLink1Description: SVN Datasheet; ComponentLink2URL: C:\ALTIUM_WORK\00001_MCHP-CDB\Datasheets\AOA0000CE1.pdf; ComponentLink2Description: Local Datasheet; ComponentLink3URL: C:\ALTIUM_WORK\00001_MCHP-CDB\Library\LibraryRefs\Resistor.SchLib; ComponentLink3Description: Open Symbol; ComponentLink4URL: C:\ALTIUM_WORK\00001_MCHP-CDB\Library\Footprints\RES_C_1206.PcbLib; ComponentLink4Description: Open Footprint; ComponentLink5Description: Open Footprint 2; ComponentLink6Description: Open Footprint 3; ComponentLink7Description: Open Footprint 4; Operating Temperature: -55C to +155C; Category: Resistor; Type: RES SMD; Composition: TKF; Manufacturer 2: Panasonic; Manufacturer Part Number 2: ERJ-8GEY0R00V; Manufacturer 3: KOA Speer; Manufacturer Part Number 3: RK73Z2BTTD; Manufacturer 4: Bourns; Manufacturer Part Number 4: CR1206-J/-000ELF; Supplier 1: Digi-Key; Supplier Part Number 1: 311-0.0ERCT-ND; Supplier 2: Digi-Key; Supplier Part Number 2: P0.0ETR-ND; Supplier 3: KOA Speer; Supplier Part Number 3: RK73Z2BTTD; Supplier 4: Mouser; Supplier Part Number 4: 652-CR1206-J/-000ELF; Quantity Override: 1
R33-R35 = RES1406: Manufacturer 1: Yageo; Manufacturer Part Number 1: RC0603FR-072K4L; Description_: RES TKF 2.4k 1% 1/10W SMD 0603; Dev Tools Status: Production; Voltage: 75V; Temperature Coeffcient: 100ppm/C; Power: 1/10W; Owner: Henry de Villiers; Populated: YES; MCHP-ID: RES1406; Revision: 1; Symbol: Resistor; Status: MCL Design; ComponentLink1URL: https://chn-vm-apps.microchip.com/mchprepo/parts/Datasheets/PYu-R_INT-thick_7.pdf; ComponentLink1Description: SVN Datasheet; ComponentLink2URL: C:\ALTIUM_WORK\00001_MCHP-CDB\Datasheets\PYu-R_INT-thick_7.pdf; ComponentLink2Description: Local Datasheet; ComponentLink3URL: C:\ALTIUM_WORK\00001_MCHP-CDB\Library\LibraryRefs\Resistor.SchLib; ComponentLink3Description: Open Symbol; ComponentLink4URL: C:\ALTIUM_WORK\00001_MCHP-CDB\Library\Footprints\RES_C_0603.PcbLib; ComponentLink4Description: Open Footprint; ComponentLink5Description: Open Footprint 2; ComponentLink6Description: Open Footprint 3; ComponentLink7Description: Open Footprint 4; Operating Temperature: -55C to +155C; Category: Resistor; Type: RES SMD; Composition: TKF; Supplier 1: Digi-Key; Supplier Part Number 1: 311-2.40KHRCT-ND; Quantity Override: 1
R36 R80 = RSMT0522: Manufacturer 1: Panasonic; Manufacturer Part Number 1: ERJ-6ENF3602V; Tolerance: 1%; Description_: RES TKF 36k 1% 1/8W SMD 0805; Dev Tools Status: Production; Voltage: 150V; Temperature Coeffcient: 100ppm/C; Power: 1/8W; Populated: Yes; MCHP-ID: RSMT0522; Package: 0805; Revision: 1; Status: MCL Design; ComponentLink1URL: https://chn-vm-apps.microchip.com/mchprepo/parts/Datasheets/AOA0000CE2.pdf; ComponentLink1Description: SVN Datasheet; Operating Temperature: -55C to +155C; Category: Resistor; Type: RES SMD; Composition: TKF; Supplier 1: Digi-Key; Supplier Part Number 1: P36.0KCCT-ND; Quantity Override: 1; ComponentLink2Description: Local Datasheet; ComponentLink2URL: C:\ALTIUM_WORK\00001_MCHP-CDB\Datasheets\AOA0000CE2.pdf; ComponentLink3Description: Open Symbol; ComponentLink3URL: C:\ALTIUM_WORK\00001_MCHP-CDB\Library\LibraryRefs\Resistor.SchLib; ComponentLink4Description: Open Footprint; ComponentLink4URL: C:\ALTIUM_WORK\00001_MCHP-CDB\Library\Footprints\RES_C_0805.PcbLib; ComponentLink5Description: Open Footprint 2; ComponentLink6Description: Open Footprint 3; ComponentLink7Description: Open Footprint 4; Symbol: Resistor
R37 = RES1406: Manufacturer 1: Yageo; Manufacturer Part Number 1: RC0603FR-072K4L; Tolerance: 1%; Description_: RES TKF 2.4K 1% 1/10W SMD 0603; Dev Tools Status: Production; Temperature Coeffcient: 100ppm/C; Power: 1/10W; Owner: Henry de Villiers; Populated: YES; MCHP-ID: RES1406; Package: 0603; Revision: 1; Status: MCL Design; ComponentLink1URL: https://chn-vm-apps.microchip.com/mchprepo/parts/Datasheets/PYu-R_INT-thick_7.pdf; ComponentLink1Description: SVN Datasheet; Operating Temperature: -55C to +155C; Category: Resistor; Type: RES SMD; Composition: TKF; Supplier 1: Digi-Key; Supplier Part Number 1: 311-2.40KHRCT-ND; Quantity Override: 1; ComponentLink2Description: Local Datasheet; ComponentLink2URL: C:\ALTIUM_WORK\00001_MCHP-CDB\Datasheets\PYu-R_INT-thick_7.pdf; ComponentLink3Description: Open Symbol; ComponentLink3URL: C:\ALTIUM_WORK\00001_MCHP-CDB\Library\LibraryRefs\Resistor.SchLib; ComponentLink4Description: Open Footprint; ComponentLink4URL: C:\ALTIUM_WORK\00001_MCHP-CDB\Library\Footprints\RES_C_0603.PcbLib; ComponentLink5Description: Open Footprint 2; ComponentLink6Description: Open Footprint 3; ComponentLink7Description: Open Footprint 4; Symbol: Resistor
R40 R45 = RES1133: Manufacturer 1: MULTICOMP; Manufacturer Part Number 1: MC 0.063W 0603 1% 2K61; Description_: RES TKF 2.61k 1% 1/16W SMD 0603; Dev Tools Status: Production; Voltage: 50V; Temperature Coeffcient: 100ppm/C; Power: 1/16W; Owner: Mihai T(M91442); Populated: Yes; MCHP-ID: RES1133; Revision: 0; Symbol: Resistor; Status: MCL Design; ComponentLink1URL: https://chn-vm-apps.microchip.com/mchprepo/parts/Datasheets/1636795.pdf; ComponentLink1Description: SVN Datasheet; ComponentLink2URL: C:\ALTIUM_WORK\00001_MCHP-CDB\Datasheets\1636795.pdf; ComponentLink2Description: Local Datasheet; ComponentLink3URL: C:\ALTIUM_WORK\00001_MCHP-CDB\Library\LibraryRefs\Resistor.SchLib; ComponentLink3Description: Open Symbol; ComponentLink4URL: C:\ALTIUM_WORK\00001_MCHP-CDB\Library\Footprints\RES_C_0603.PcbLib; ComponentLink4Description: Open Footprint; ComponentLink5Description: Open Footprint 2; ComponentLink6Description: Open Footprint 3; ComponentLink7Description: Open Footprint 4; Operating Temperature: -55C to +155C; Category: Resistor; Type: RES SMD; Composition: TKF; Supplier 1: Farnell; Supplier Part Number 1: 1170828; Quantity Override: 1
R46 R48 R54 = RES1130: Manufacturer 1: Panasonic; Manufacturer Part Number 1: ERJ-3EKF2201V; Tolerance: 1%; Description_: RES TKF 2.2k 1% 1/10W SMD 0603; Dev Tools Status: Production; Voltage: 75V; Temperature Coeffcient: 100ppm/C; Power: 1/10W; Populated: Yes; Owner: Bogdan P (M91398); MCHP-ID: RES1130; Package: 0603; Revision: 0; Symbol: Resistor; Status: MCL Design; ComponentLink1URL: https://chn-vm-apps.microchip.com/mchprepo/parts/Datasheets/AOA0000CE2.pdf; ComponentLink1Description: SVN Datasheet; ComponentLink2URL: C:\ALTIUM_WORK\00001_MCHP-CDB\Datasheets\AOA0000CE2.pdf; ComponentLink2Description: Local Datasheet; ComponentLink3URL: C:\ALTIUM_WORK\00001_MCHP-CDB\Library\LibraryRefs\Resistor.SchLib; ComponentLink3Description: Open Symbol; ComponentLink4URL: C:\ALTIUM_WORK\00001_MCHP-CDB\Library\Footprints\RES_C_0603.PcbLib; ComponentLink4Description: Open Footprint; ComponentLink5Description: Open Footprint 2; ComponentLink6Description: Open Footprint 3; ComponentLink7Description: Open Footprint 4; Operating Temperature: -55C to +155C; Category: Resistor; Type: RES SMD; Composition: TKF; Supplier 1: Digi-Key; Supplier Part Number 1: P2.20KHCT-ND; Quantity Override: 1
R47 = RSMT0309: Manufacturer 1: Panasonic; Manufacturer Part Number 1: ERJ-3EKF2002V; Description_: RES TKF 20k 1% 1/10W SMD 0603; Dev Tools Status: Production; Voltage: 50V; Temperature Coeffcient: 100ppm/C; Power: 1/10W; Populated: Yes; MCHP-ID: RSMT0309; Revision: 1; Symbol: Resistor; Status: MCL Design; ComponentLink1URL: https://chn-vm-apps.microchip.com/mchprepo/parts/Datasheets/PYu-RC0603_51_RoHS_L_4.pdf; ComponentLink1Description: SVN Datasheet; ComponentLink2URL: C:\ALTIUM_WORK\00001_MCHP-CDB\Datasheets\PYu-RC0603_51_RoHS_L_4.pdf; ComponentLink2Description: Local Datasheet; ComponentLink3URL: C:\ALTIUM_WORK\00001_MCHP-CDB\Library\LibraryRefs\Resistor.SchLib; ComponentLink3Description: Open Symbol; ComponentLink4URL: C:\ALTIUM_WORK\00001_MCHP-CDB\Library\Footprints\RES_C_0603.PcbLib; ComponentLink4Description: Open Footprint; ComponentLink5Description: Open Footprint 2; ComponentLink6Description: Open Footprint 3; ComponentLink7Description: Open Footprint 4; Operating Temperature: -55C to +155C; Category: Resistor; Type: RES SMD; Composition: TKF; Manufacturer 2: Yageo; Manufacturer Part Number 2: 9C06031A2002FKHFT; Manufacturer 3: Yageo; Manufacturer Part Number 3: RC0603FR-0720KL; Manufacturer 4: Stackpole Electronics Inc; Manufacturer Part Number 4: RMCF1/1620.0K1%TR; Manufacturer 5: Yageo; Manufacturer Part Number 5: 9C06031A2002FKPFT; Supplier 1: Digi-Key; Supplier Part Number 1: P20.0KHCT-ND; Supplier 2: Digi-Key; Supplier Part Number 2: 311-20.0KHTR-ND; Supplier 3: Digi-Key; Supplier Part Number 3: 311-20.0KHRCT-ND; Supplier 4: Yageo; Supplier Part Number 4: RC0603FR-0720KL; Supplier 5: Stackpole Electronics Inc; Supplier Part Number 5: RMCF1/1620.0K1%TR; Supplier 6: Yageo; Supplier Part Number 6: 9C06031A2002FKPFT; Quantity Override: 1
R49-R51 = RES1130: Manufacturer 1: Panasonic; Manufacturer Part Number 1: ERJ-3EKF2201V; Description_: RES TKF 2.2k 1% 1/10W SMD 0603; Dev Tools Status: Production; Power: 1/10W; Populated: Yes; Tolerance: 1%; Voltage: 75V; Temperature Coeffcient: 100ppm/C; Owner: Bogdan P (M91398); MCHP-ID: RES1130; Package: 0603; Revision: 0; Symbol: Resistor; Status: MCL Design; ComponentLink1URL: https://chn-vm-apps.microchip.com/mchprepo/parts/Datasheets/AOA0000CE2.pdf; ComponentLink1Description: SVN Datasheet; ComponentLink2URL: C:\ALTIUM_WORK\00001_MCHP-CDB\Datasheets\AOA0000CE2.pdf; ComponentLink2Description: Local Datasheet; ComponentLink3URL: C:\ALTIUM_WORK\00001_MCHP-CDB\Library\LibraryRefs\Resistor.SchLib; ComponentLink3Description: Open Symbol; ComponentLink4URL: C:\ALTIUM_WORK\00001_MCHP-CDB\Library\Footprints\RES_C_0603.PcbLib; ComponentLink4Description: Open Footprint; ComponentLink5Description: Open Footprint 2; ComponentLink6Description: Open Footprint 3; ComponentLink7Description: Open Footprint 4; Operating Temperature: -55C to +155C; Category: Resistor; Type: RES SMD; Composition: TKF; Supplier 1: Digi-Key; Supplier Part Number 1: P2.20KHCT-ND; Quantity Override: 1
R76 = RSMT0349: Manufacturer 1: Vishay; Manufacturer Part Number 1: CRCW06033K30FKEA; Description_: RES TKF 3.3k 1% 1/10W SMD 0603; Dev Tools Status: Production; Temperature Coeffcient: 100ppm/C; Power: 1/10W; Populated: Yes; Voltage: 75V; MCHP-ID: RSMT0349; Revision: 2; Symbol: Resistor; Status: MCL Design; ComponentLink1URL: https://chn-vm-apps.microchip.com/mchprepo/parts/Datasheets/dcrcwe3.pdf; ComponentLink1Description: SVN Datasheet; ComponentLink2URL: C:\ALTIUM_WORK\00001_MCHP-CDB\Datasheets\dcrcwe3.pdf; ComponentLink2Description: Local Datasheet; ComponentLink3URL: C:\ALTIUM_WORK\00001_MCHP-CDB\Library\LibraryRefs\Resistor.SchLib; ComponentLink3Description: Open Symbol; ComponentLink4URL: C:\ALTIUM_WORK\00001_MCHP-CDB\Library\Footprints\RES_C_0603.PcbLib; ComponentLink4Description: Open Footprint; ComponentLink5Description: Open Footprint 2; ComponentLink6Description: Open Footprint 3; ComponentLink7Description: Open Footprint 4; Operating Temperature: -55C to +155C; Category: Resistor; Type: RES SMD; Composition: TKF; Manufacturer 2: Stackpole Electronics Inc; Manufacturer Part Number 2: RMCF0603FT3K30; Manufacturer 3: Vishay; Manufacturer Part Number 3: CRCW06033K30FKEA; Manufacturer 4: Vishay; Manufacturer Part Number 4: CRCW06033K30FKEA; Manufacturer 5: Vishay; Manufacturer Part Number 5: CRCW06033K30FKEA; Supplier 1: Avnet; Supplier Part Number 1: CRCW06033K30FKEA/BKN; Supplier 2: Digi-Key; Supplier Part Number 2: RMCF0603FT3K30CT-ND; Supplier 3: Digi-Key; Supplier Part Number 3: 541-3.30KHTR-ND; Supplier 4: Mouser; Supplier Part Number 4: 71-CRCW0603-3.3K-E3; Supplier 5: Newark; Supplier Part Number 5: 52K8376; Quantity Override: 1
R77-R79 R83 = RSMT0139: Manufacturer 1: Panasonic; Manufacturer Part Number 1: ERJ-3EKF1002V; Description_: RES TKF 10k 1% 1/10W SMD 0603; Dev Tools Status: Production; Temperature Coeffcient: 100ppm/C; Power: 1/10W; Populated: Yes; MCHP-ID: RSMT0139; Revision: 2; Symbol: Resistor; Status: MCL Design; ComponentLink1URL: https://chn-vm-apps.microchip.com/mchprepo/parts/Datasheets/nrc.pdf; ComponentLink1Description: SVN Datasheet; ComponentLink2URL: C:\ALTIUM_WORK\00001_MCHP-CDB\Datasheets\nrc.pdf; ComponentLink2Description: Local Datasheet; ComponentLink3URL: C:\ALTIUM_WORK\00001_MCHP-CDB\Library\LibraryRefs\Resistor.SchLib; ComponentLink3Description: Open Symbol; ComponentLink4URL: C:\ALTIUM_WORK\00001_MCHP-CDB\Library\Footprints\RES_C_0603.PcbLib; ComponentLink4Description: Open Footprint; ComponentLink5Description: Open Footprint 2; ComponentLink6Description: Open Footprint 3; ComponentLink7Description: Open Footprint 4; Operating Temperature: -55C to +155C; Category: Resistor; Type: RES SMD; Composition: TKF; Manufacturer 2: Stackpole Electronics Inc; Manufacturer Part Number 2: RMCF0603FT10K0; Manufacturer 3: Stackpole Electronics Inc; Manufacturer Part Number 3: RMCF 1/16 10K 1% R; Manufacturer 4: Yageo; Manufacturer Part Number 4: RC0603FR-0710KL; Manufacturer 5: Xicon; Manufacturer Part Number 5: 302-10K-RC; Manufacturer 6: NIC Components; Manufacturer Part Number 6: NRC06F1002TRF; Supplier 1: Digi-Key; Supplier Part Number 1: P10.0KHCT-ND; Supplier 2: Digi-Key; Supplier Part Number 2: RMCF1/1610KFRTR-ND; Supplier 3: Digi-Key; Supplier Part Number 3: RMCF0603FT10K0TR-ND; Supplier 4: Digi-Key; Supplier Part Number 4: 311-10.0KHRCT-ND; Supplier 5: Mouser; Supplier Part Number 5: 302-10k-RC; Supplier 6: NIC Components; Supplier Part Number 6: NRC06F1002TRF; Quantity Override: 1
R81 = RSMT0465: Manufacturer 1: Panasonic; Manufacturer Part Number 1: ERJ-3EKF7501V; Description_: RES TKF 7.5k 1% 1/10W SMD 0603; Dev Tools Status: Production; Voltage: 75V; Temperature Coeffcient: 100ppm/C; Power: 1/10W; Populated: Yes; MCHP-ID: RSMT0465; Revision: 1; Symbol: Resistor; Status: MCL Design; ComponentLink1URL: https://chn-vm-apps.microchip.com/mchprepo/parts/Datasheets/AOA0000CE2.pdf; ComponentLink1Description: SVN Datasheet; ComponentLink2URL: C:\ALTIUM_WORK\00001_MCHP-CDB\Datasheets\AOA0000CE2.pdf; ComponentLink2Description: Local Datasheet; ComponentLink3URL: C:\ALTIUM_WORK\00001_MCHP-CDB\Library\LibraryRefs\Resistor.SchLib; ComponentLink3Description: Open Symbol; ComponentLink4URL: C:\ALTIUM_WORK\00001_MCHP-CDB\Library\Footprints\RES_C_0603.PcbLib; ComponentLink4Description: Open Footprint; ComponentLink5Description: Open Footprint 2; ComponentLink6Description: Open Footprint 3; ComponentLink7Description: Open Footprint 4; Operating Temperature: -55C to +155C; Category: Resistor; Type: RES SMD; Composition: TKF; Manufacturer 2: ROHM; Manufacturer Part Number 2: MCR03EZPFX7501; Manufacturer 3: Vishay; Manufacturer Part Number 3: CRCW06037K50FKEA; Manufacturer 4: Yageo; Manufacturer Part Number 4: RC0603FR-077K5L; Supplier 1: Digi-Key; Supplier Part Number 1: P7.50KHCT-ND; Supplier 2: Digi-Key; Supplier Part Number 2: RHM7.50KHCT-ND; Supplier 3: Digi-Key; Supplier Part Number 3: 541-7.50KHCT-ND; Supplier 4: Digi-Key; Supplier Part Number 4: 311-7.50KHRCT-ND; Quantity Override: 1